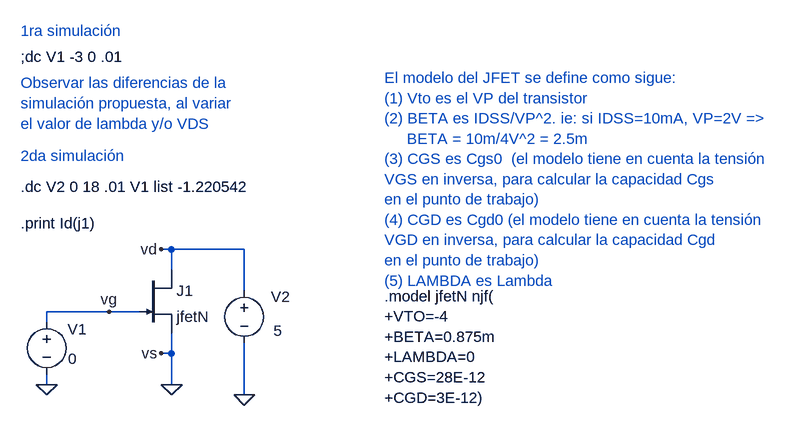
[diagram p0: schematic JFETN-Salida.asc]
JFETN-Salida.asc, the LTspice schematic file:
Version 4
SHEET 1 2032 680
WIRE 208 192 192 192
WIRE 320 192 208 192
WIRE 208 224 208 192
WIRE 320 256 320 192
WIRE 112 288 16 288
WIRE 160 288 112 288
WIRE 16 304 16 288
WIRE 208 352 208 320
WIRE 208 352 192 352
WIRE 16 400 16 384
WIRE 208 400 208 352
WIRE 320 416 320 336
FLAG 320 416 0
FLAG 208 400 0
FLAG 112 288 vg
FLAG 192 352 vs
FLAG 192 192 vd
FLAG 16 400 0
SYMBOL voltage 16 288 R0
WINDOW 0 32 27 Left 2
WINDOW 3 33 72 Left 2
WINDOW 123 0 0 Left 2
WINDOW 39 0 0 Left 2
SYMATTR InstName V1
SYMATTR Value 0
SYMBOL voltage 320 240 R0
WINDOW 0 41 25 Left 2
WINDOW 3 45 77 Left 2
WINDOW 123 0 0 Left 2
WINDOW 39 0 0 Left 2
SYMATTR InstName V2
SYMATTR Value 5
SYMBOL njf 160 224 R0
SYMATTR InstName J1
SYMATTR Value jfetN
TEXT -24 -64 Left 2 ;Observar las diferencias de la \nsimulación propuesta, al variar \nel valor de lambda y/o VDS
TEXT -24 -104 Left 2 !;dc V1 -3 0 .01
TEXT -24 -144 Left 2 ;1ra simulación
TEXT -24 48 Left 2 ;2da simulación
TEXT -24 96 Left 2 !.dc V2 0 18 .01 V1 list -1.220542
TEXT -24 152 Left 2 !.print Id(j1)
TEXT 536 -72 Left 2 ;El modelo del JFET se define como sigue:\n(1) Vto es el VP del transistor\n(2) BETA es IDSS/VP^2. ie: si IDSS=10mA, VP=2V =>\n     BETA = 10m/4V^2 = 2.5m\n(3) CGS es Cgs0  (el modelo tiene en cuenta la tensión \nVGS en inversa, para calcular la capacidad Cgs \nen el punto de trabajo)\n(4) CGD es Cgd0 (el modelo tiene en cuenta la tensión \nVGD en inversa, para calcular la capacidad Cgd \nen el punto de trabajo)\n(5) LAMBDA es Lambda
TEXT 536 264 Left 2 !.model jfetN njf(\n+VTO=-4\n+BETA=0.875m\n+LAMBDA=0\n+CGS=28E-12\n+CGD=3E-12)

The netlist it stands for:
* JFETN-Salida.asc
V1 vg 0 0
V2 vd 0 5
J1 vd vg 0 jfetN
.model NJF NJF
.model PJF PJF
.lib standard.jft
* Observar las diferencias de la
* simulación propuesta, al variar
* el valor de lambda y/o VDS
;dc V1 -3 0 .01
* 1ra simulación
* 2da simulación
.dc V2 0 18 .01 V1 list -1.220542
.print Id(j1)
* El modelo del JFET se define como sigue:
* (1) Vto es el VP del transistor
* (2) BETA es IDSS/VP^2. ie: si IDSS=10mA, VP=2V =>
*      BETA = 10m/4V^2 = 2.5m
* (3) CGS es Cgs0  (el modelo tiene en cuenta la tensión
* VGS en inversa, para calcular la capacidad Cgs
* en el punto de trabajo)
* (4) CGD es Cgd0 (el modelo tiene en cuenta la tensión
* VGD en inversa, para calcular la capacidad Cgd
* en el punto de trabajo)
* (5) LAMBDA es Lambda
.model jfetN njf(
+VTO=-4
+BETA=0.875m
+LAMBDA=0
+CGS=28E-12
+CGD=3E-12)
.backanno
.end